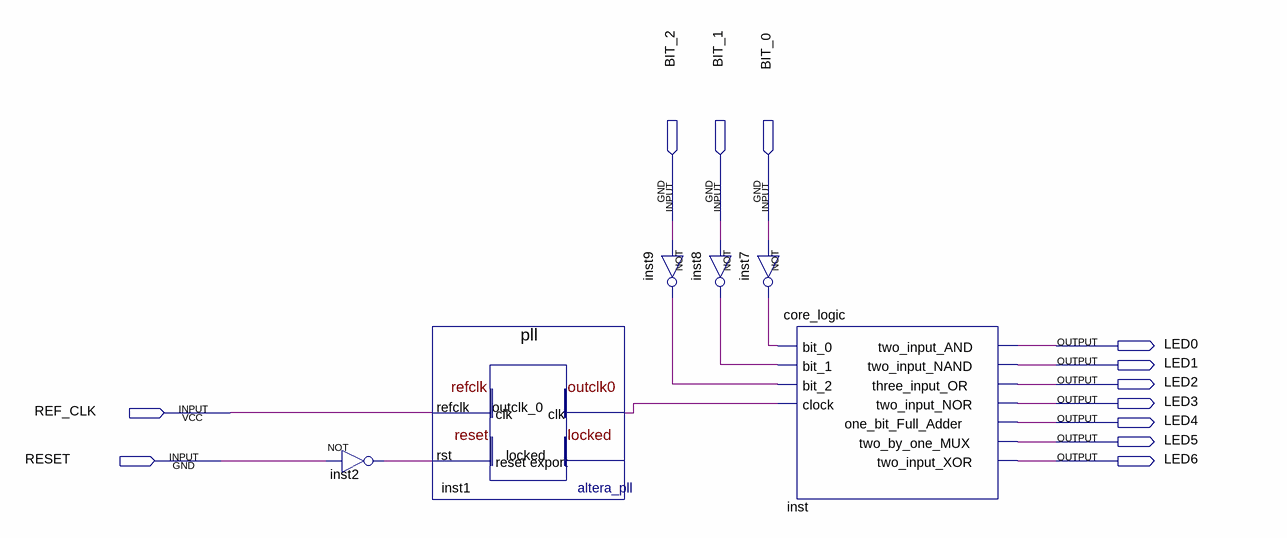
[diagram p0: schematic sheet]
// Quartus schematic project1-logic-gates.bdf as structural Verilog: 6 symbols, 12 pins
module \project1-logic-gates  (
  input  BIT_2,
  input  BIT_1,
  input  BIT_0,
  input  REF_CLK,
  input  RESET,
  output LED0,
  output LED1,
  output LED2,
  output LED3,
  output LED4,
  output LED5,
  output LED6
);

  wire inst1_outclk_0, inst2_out, inst7_out, inst8_out, inst9_out;

  not inst2 (inst2_out, RESET);
  pll inst1 (.refclk(REF_CLK), .rst(inst2_out), .outclk_0(inst1_outclk_0));  // open: locked
  not inst9 (inst9_out, BIT_2);
  not inst7 (inst7_out, BIT_0);
  not inst8 (inst8_out, BIT_1);
  core_logic inst (
    .bit_0(inst7_out), .bit_1(inst8_out), .bit_2(inst9_out), .clock(inst1_outclk_0), .two_input_AND(LED0),
    .two_input_NAND(LED1), .three_input_OR(LED2), .two_input_NOR(LED3), .one_bit_Full_Adder(LED4),
    .two_by_one_MUX(LED5), .two_input_XOR(LED6));
endmodule
